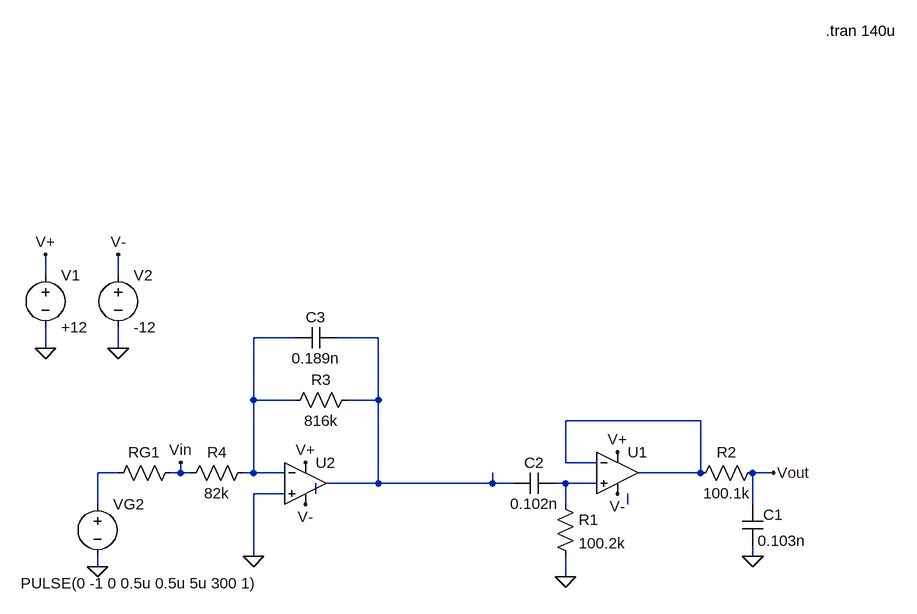
[diagram p0: schematic shaper_undershoot.asc]
shaper_undershoot.asc, the LTspice schematic file:
Version 4
SHEET 1 880 680
WIRE -1248 48 -1248 16
WIRE -1136 48 -1136 16
WIRE -864 144 -928 144
WIRE -736 144 -800 144
WIRE -1248 160 -1248 128
WIRE -1136 160 -1136 128
WIRE -928 240 -928 144
WIRE -864 240 -928 240
WIRE -736 240 -736 144
WIRE -736 240 -784 240
WIRE -240 272 -448 272
WIRE -448 336 -448 272
WIRE -400 336 -448 336
WIRE -1136 352 -1168 352
WIRE -1040 352 -1040 336
WIRE -1040 352 -1056 352
WIRE -1024 352 -1040 352
WIRE -928 352 -928 240
WIRE -928 352 -944 352
WIRE -880 352 -928 352
WIRE -240 352 -240 272
WIRE -240 352 -336 352
WIRE -128 352 -160 352
WIRE -736 368 -736 240
WIRE -736 368 -816 368
WIRE -560 368 -560 352
WIRE -560 368 -736 368
WIRE -528 368 -560 368
WIRE -448 368 -464 368
WIRE -400 368 -448 368
WIRE -880 384 -928 384
WIRE -832 384 -832 368
WIRE -1168 400 -1168 352
WIRE -448 400 -448 368
WIRE -352 400 -352 384
WIRE -160 400 -160 352
WIRE -928 480 -928 384
WIRE -160 480 -160 464
WIRE -1168 496 -1168 480
WIRE -448 512 -448 480
FLAG -1248 160 0
FLAG -1136 160 0
FLAG -1248 16 V+
FLAG -1136 16 V-
FLAG -128 352 Vout
FLAG -368 384 V-
FLAG -368 320 V+
FLAG -448 512 0
FLAG -160 480 0
FLAG -1040 336 Vin
FLAG -848 400 V-
FLAG -848 336 V+
FLAG -1168 496 0
FLAG -928 480 0
SYMBOL voltage -1248 32 R0
WINDOW 123 24 126 Left 2
WINDOW 39 24 111 Left 2
SYMATTR InstName V1
SYMATTR Value +12
SYMBOL voltage -1136 32 R0
WINDOW 123 24 126 Left 2
WINDOW 39 24 111 Left 2
SYMATTR InstName V2
SYMATTR Value -12
SYMBOL Opamps/UniversalOpamp2 -368 352 R0
SYMATTR InstName U1
SYMBOL res -464 384 R0
SYMATTR InstName R1
SYMATTR Value 100.2k
SYMBOL res -144 336 R90
WINDOW 0 0 56 VBottom 2
WINDOW 3 32 56 VTop 2
SYMATTR InstName R2
SYMATTR Value 100.1k
SYMBOL cap -176 400 R0
WINDOW 0 32 16 Left 2
SYMATTR InstName C1
SYMATTR Value 0.103n
SYMBOL cap -464 352 R90
WINDOW 0 0 32 VBottom 2
WINDOW 3 32 32 VTop 2
SYMATTR InstName C2
SYMATTR Value 0.102n
SYMBOL Opamps/UniversalOpamp2 -848 368 R0
SYMATTR InstName U2
SYMBOL voltage -1168 384 R0
WINDOW 3 -118 138 Left 2
WINDOW 39 0 0 Left 0
SYMATTR Value PULSE(0 -1 0 0.5u 0.5u 5u 300 1)
SYMATTR Value2 AC 1 0
SYMATTR InstName VG2
SYMBOL res -1040 336 R90
WINDOW 0 0 56 VBottom 2
WINDOW 3 32 56 Invisible 2
SYMATTR InstName RG1
SYMATTR Value 600
SYMBOL res -768 224 R90
WINDOW 0 0 56 VBottom 2
WINDOW 3 32 56 VTop 2
SYMATTR InstName R3
SYMATTR Value 816k
SYMBOL cap -800 128 R90
WINDOW 0 0 32 VBottom 2
WINDOW 3 32 32 VTop 2
SYMATTR InstName C3
SYMATTR Value 0.189n
SYMBOL res -928 336 R90
WINDOW 0 0 56 VBottom 2
WINDOW 3 32 56 VTop 2
SYMATTR InstName R4
SYMATTR Value 82k
TEXT -48 -328 Left 2 !.tran 140u

The netlist it stands for:
* shaper_undershoot.asc
V1 V+ 0 +12
V2 V- 0 -12
XU1 N005 N003 V+ V- N003 level.2 Avol=1Meg GBW=10Meg Slew=10Meg ilimit=25m rail=0 Vos=0 phimargin=45 en=0 enk=0 in=0 ink=0 Rin=500Meg  ; pins IN+ IN- V+ V- OUT
R1 N005 0 100.2k
R2 Vout N003 100.1k
C1 Vout 0 0.103n
C2 N005 N002 0.102n
XU2 0 N001 V+ V- N002 level.2 Avol=1Meg GBW=10Meg Slew=10Meg ilimit=25m rail=0 Vos=0 phimargin=45 en=0 enk=0 in=0 ink=0 Rin=500Meg  ; pins IN+ IN- V+ V- OUT
VG2 N004 0 PULSE(0 -1 0 0.5u 0.5u 5u 300 1) AC 1 0
RG1 Vin N004 600
R3 N002 N001 816k
C3 N002 N001 0.189n
R4 N001 Vin 82k
.tran 140u
.lib UniversalOpamps2.sub
.backanno
.end